# EAGLE board electronGPS (EAGLE 7.3.0)
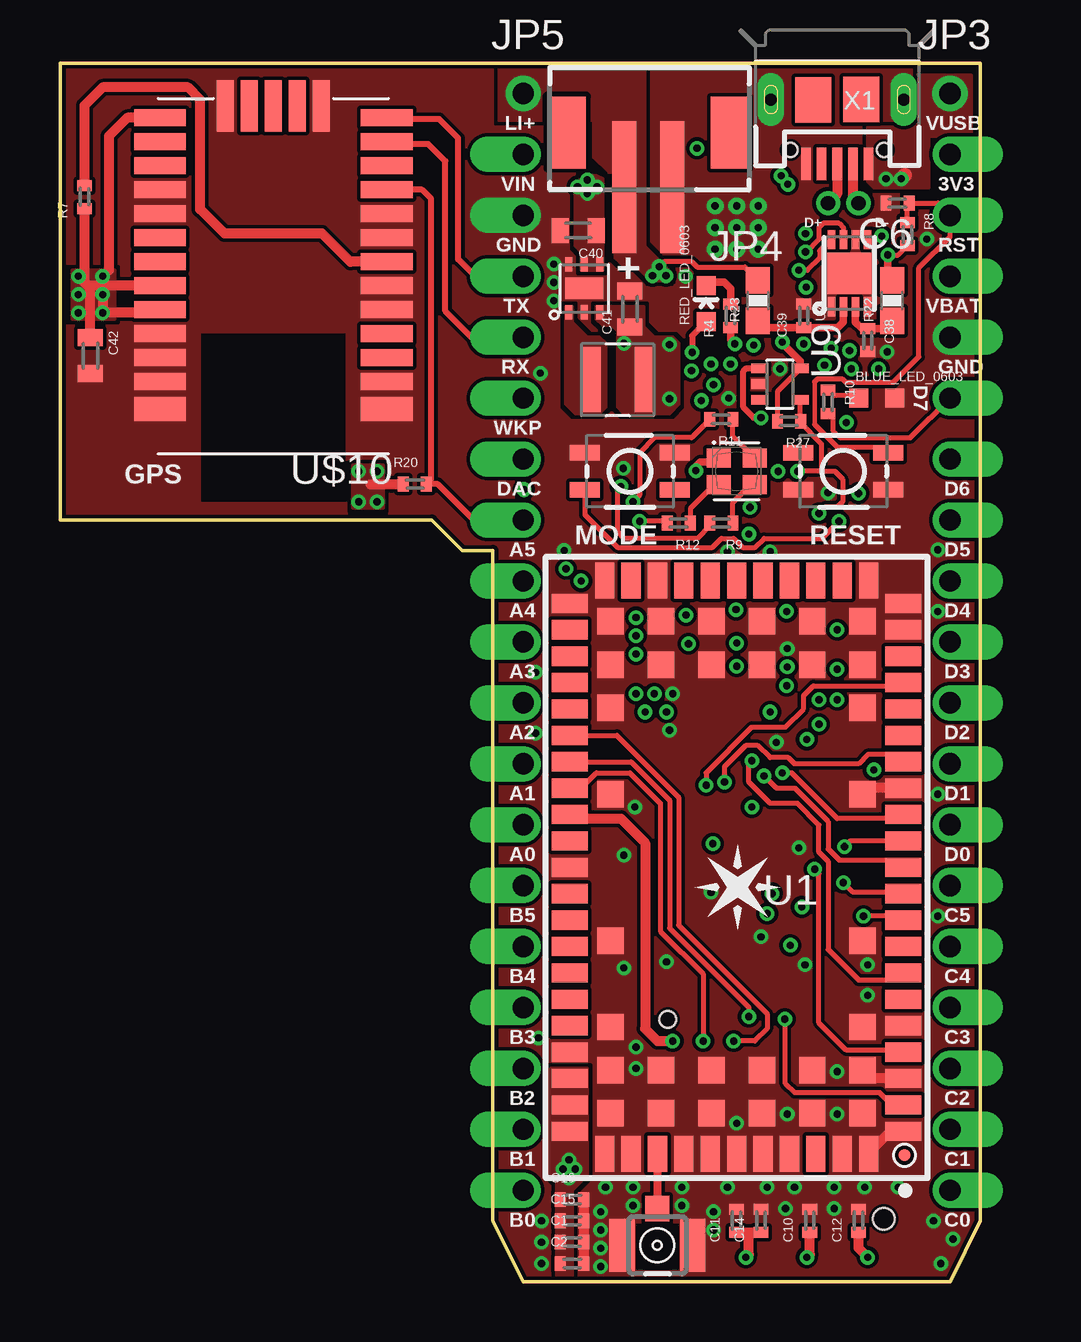
[diagram p4: board, top side]
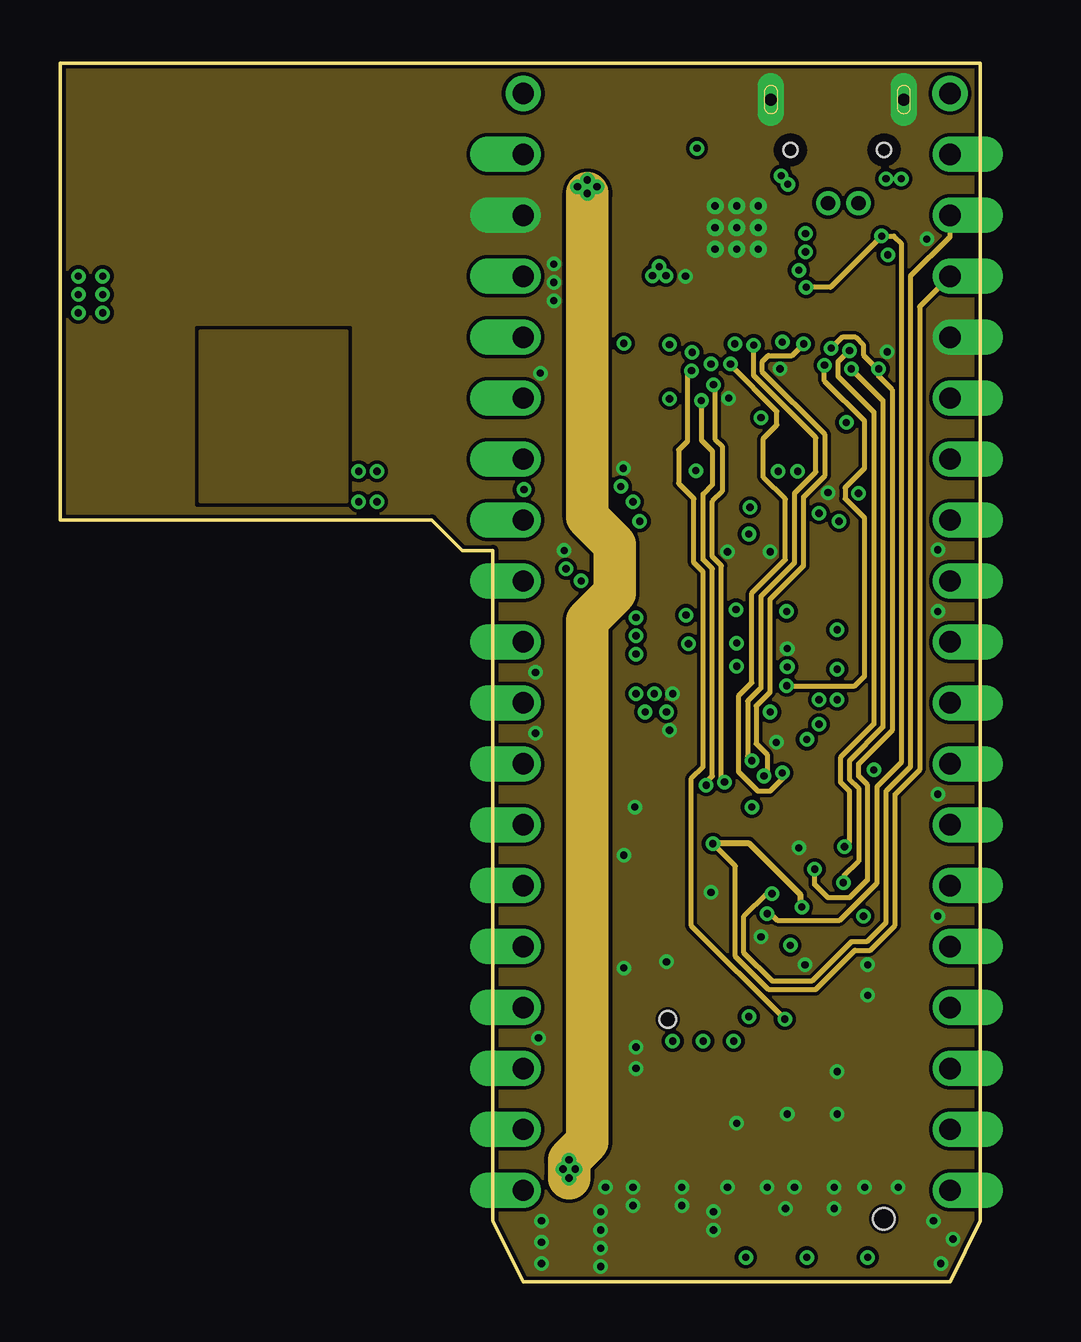
[diagram p5: board, inner layer $GND]
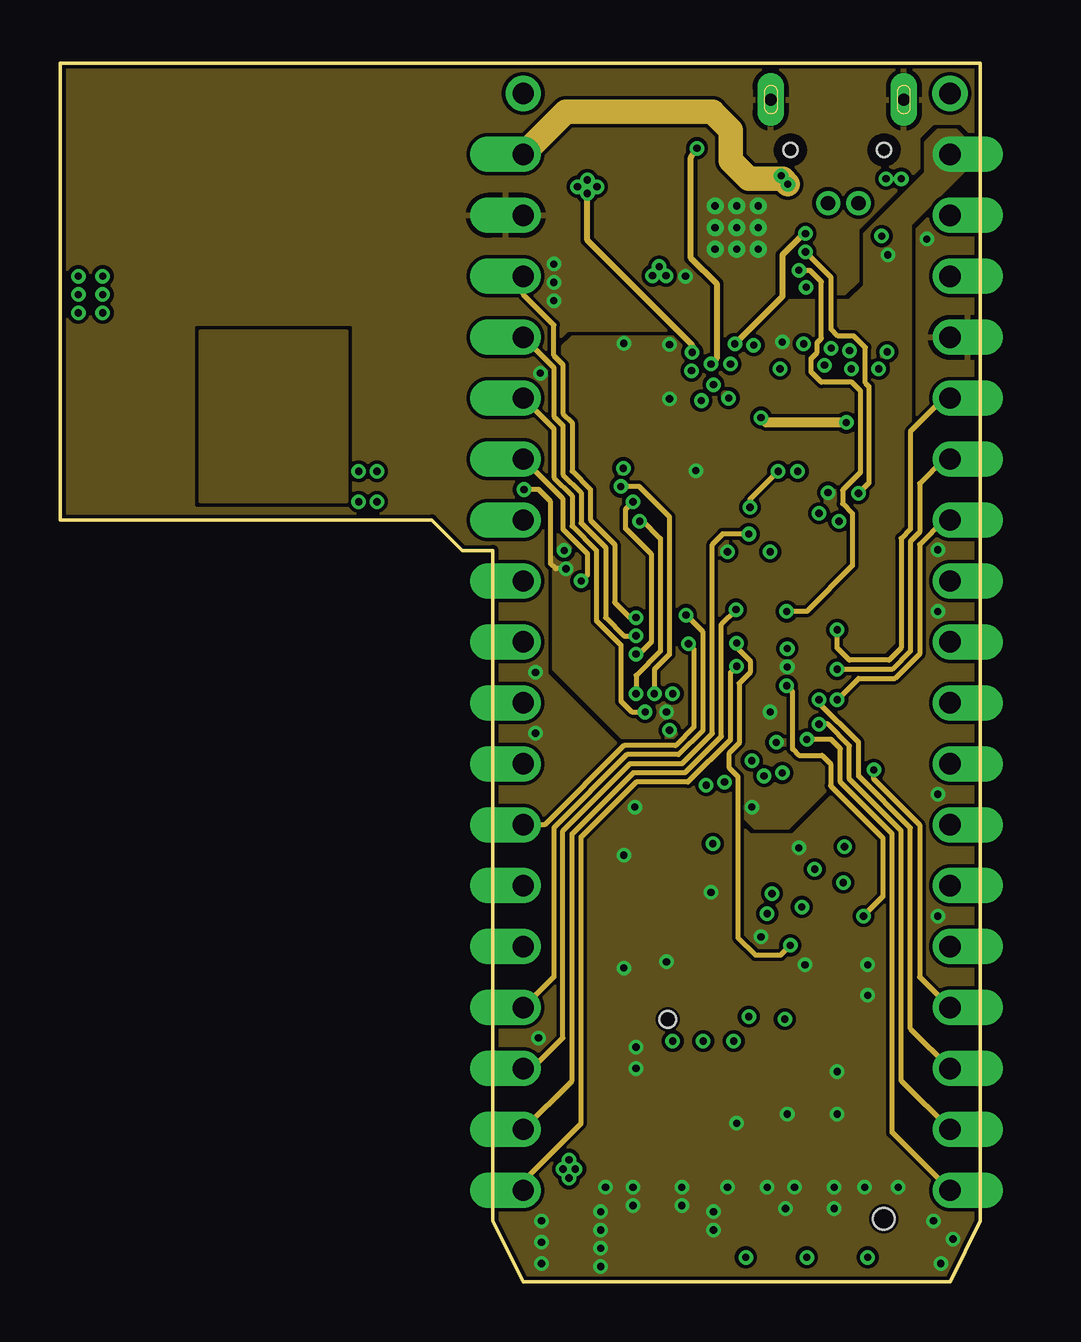
[diagram p6: board, inner layer $+3V3]
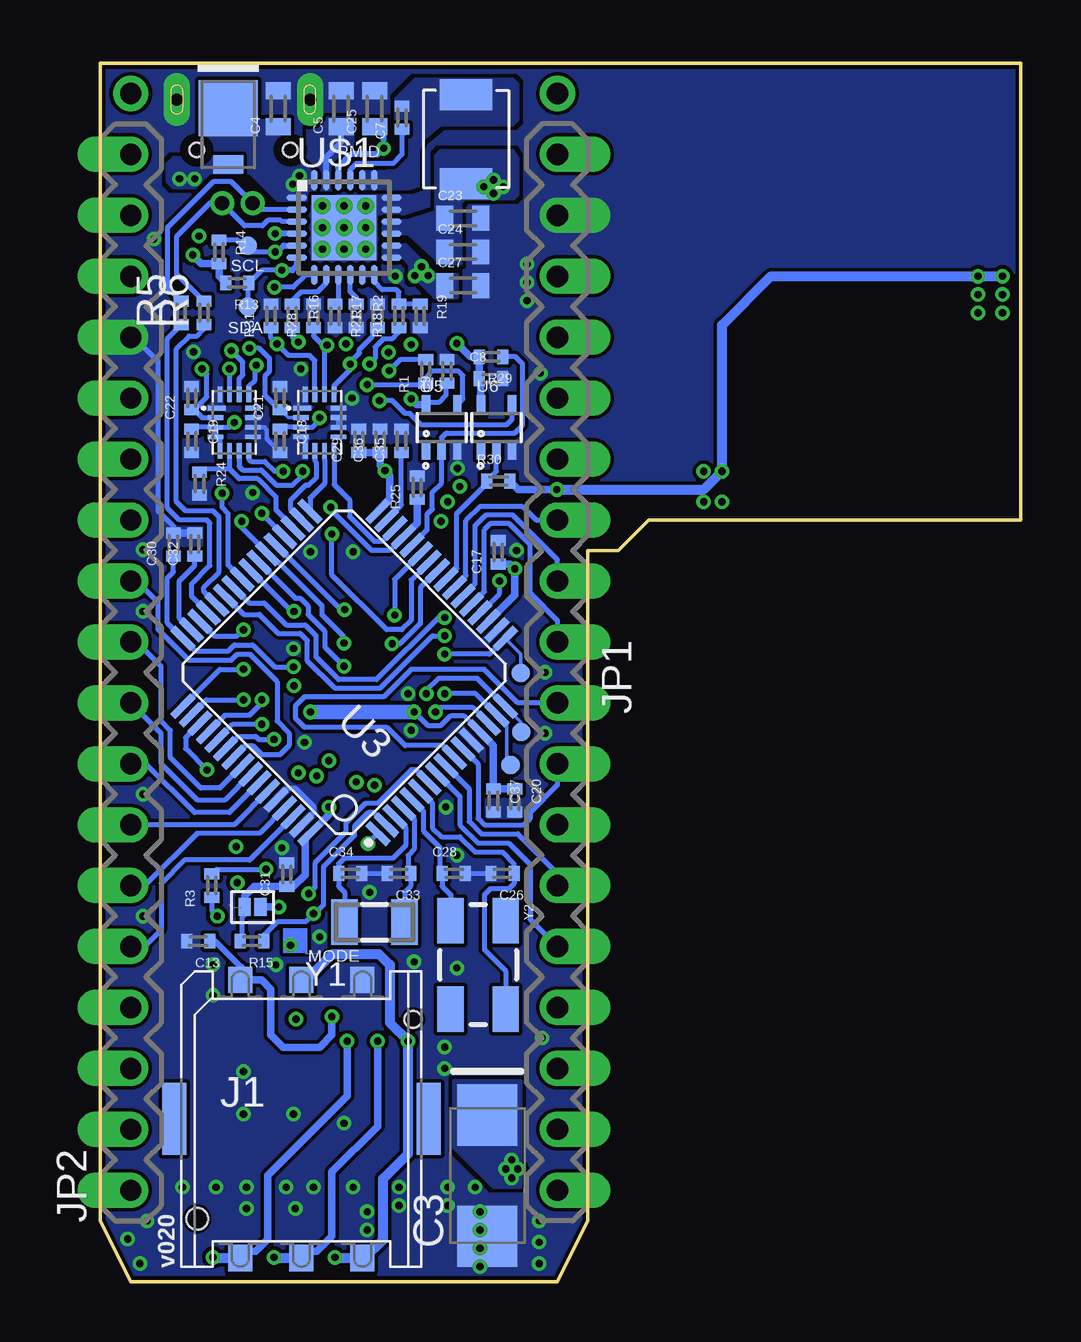
[diagram p7: board, bottom side, seen from below]

Size 38.35 x 50.8 mm. Coordinates in mm from the lower left corner, seen from the top.
Outline: 18.03,2.54 19.3,0 37.08,0 38.35,2.54 38.35,50.8 0,50.8 0,31.75 15.49,31.75 16.76,30.48 18.03,30.48 18.03,2.54
Copper layers (1+2*15+16): Top 0.018mm / dielectric 0.195mm / $GND 0.035mm / dielectric 1.1mm / $+3V3 0.035mm / dielectric 0.195mm / Bottom 0.018mm
Design rules "particle-4layer": minimum track width 6mil, minimum drill 0.3mm, track to track 6mil, track to pad 6mil, pad to pad 6mil, via to via 6mil, smd to smd 6mil, copper to edge 6mil, drill to drill 6mil, minimum pad ring 8mil, minimum via ring 6mil, stop-mask expansion 4mil, vias tented up to drill 20mil, thermal gap 8mil
Net classes: 2 RF: width 0.33 mm, clearance 0.191 mm; 3 BAT: clearance 0.203 mm

## Footprints (pad centres in the part's own frame; a part is rotated, then mirrored left to right if it is on the bottom)
LED-0603-NS = smd 0.8 x 0.8: A -0.75,0; C 0.75,0
C0402_B = smd 0.457 x 0.61: 1 -0.483,0; 2 0.483,0
C/6032-28R = smd 2.55 x 2.5: + 2.525,0; - -2.525,0
C0603_B = smd 0.711 x 1.041: 1 -0.749,0; 2 0.749,0
GCT-SIM8100 = smd 1 x 1.1: C1 2.54,-5.8; C2 0,-5.8; C3 -2.54,-5.8; C5 2.54,5.8; C6 0,5.8; C7 -2.54,5.8 | smd 1 x 3: NC@1 -5.3,0; NC@2 5.3,0 | hole 0.7: 4.65,4.15 | hole 0.9: -4.35,-4.15
IPEX-20279-001E = smd 1 x 1.05: 1 0,1.528 | smd 1.05 x 2.2: 2@1 -1.475,0; 2@2 1.475,0
JUMPER_SMD_NC = smd 0.508 x 0.762: 1 -0.33,0; 2 0.33,0
1X18-D-PADS = drill 0.889 pad 1.473 offset: 1 -21.59,0; 2 -19.05,0; 3 -16.51,0; 4 -13.97,0; 5 -11.43,0; 6 -8.89,0; 7 -6.35,0; 8 -3.81,0; 9 -1.27,0; 10 1.27,0; 11 3.81,0; 12 6.35,0; 13 8.89,0; 14 11.43,0; 15 13.97,0; 16 16.51,0; 17 19.05,0; 18 21.59,0
1X01_NO_SILK = drill 0.889 pad 1.473: 1 0,0
JST-2-SMD-VERT = smd 1 x 5.5: GND 1,-2; VCC -1,-2 | smd 1.6 x 3: P$1 -3.4,0.27; P$2 3.4,0.27
PLCC4-2MM-RGB = smd 1 x 0.8: BLUE -0.75,-0.55; CA 0.75,-0.55; GREEN -0.75,0.55; RED 0.75,0.55
R0402_B = smd 0.457 x 0.61: 1 -0.483,0; 2 0.483,0
0603-RES = smd 1.1 x 1: 1 -0.85,0; 2 0.85,0
LED-0603 = smd 0.8 x 0.8: A 0,-0.75; C 0,0.75
TACTILE_SWITCH_SMD = smd 1.25 x 0.65: 1 -1.875,0.775; 2 1.875,0.775; 3 -1.875,-0.775; 4 1.875,-0.775
U-BLOX-SARA-U2 = smd 1.5 x 0.8: 1 -6.95,11; 2 -6.95,9.9; 3 -6.95,8.8; 4 -6.95,7.7; 5 -6.95,6.6; 6 -6.95,5.5; 7 -6.95,4.4; 8 -6.95,3.3; 9 -6.95,2.2; 10 -6.95,1.1; 11 -6.95,0; 12 -6.95,-1.1; 13 -6.95,-2.2; 14 -6.95,-3.3; 15 -6.95,-4.4; 16 -6.95,-5.5; 17 -6.95,-6.6; 18 -6.95,-7.7; 19 -6.95,-8.8; 20 -6.95,-9.9; 21 -6.95,-11; 33 6.95,-11; 34 6.95,-9.9; 35 6.95,-8.8; 36 6.95,-7.7; 37 6.95,-6.6; 38 6.95,-5.5; 39 6.95,-4.4; 40 6.95,-3.3; 41 6.95,-2.2; 42 6.95,-1.1; 43 6.95,0; 44 6.95,1.1; 45 6.95,2.2; 46 6.95,3.3; 47 6.95,4.4; 48 6.95,5.5; 49 6.95,6.6; 50 6.95,7.7; 51 6.95,8.8; 52 6.95,9.9; 53 6.95,11 | smd 0.8 x 1.5: 22 -5.5,-11.95; 23 -4.4,-11.95; 24 -3.3,-11.95; 25 -2.2,-11.95; 26 -1.1,-11.95; 27 0,-11.95; 28 1.1,-11.95; 29 2.2,-11.95; 30 3.3,-11.95; 31 4.4,-11.95; 32 5.5,-11.95; 54 5.5,11.95; 55 4.4,11.95; 56 3.3,11.95; 57 2.2,11.95; 58 1.1,11.95; 59 0,11.95; 60 -1.1,11.95; 61 -2.2,11.95; 62 -3.3,11.95; 63 -4.4,11.95; 64 -5.5,11.95 | smd 1.1 x 1.1: 65 -5.25,10.25; 66 -3.15,10.25; 67 -1.05,10.25; 68 1.05,10.25; 69 3.15,10.25; 70 5.25,10.25; 71 -5.25,8.45; 72 -3.15,8.45; 73 -1.05,8.45; 74 1.05,8.45; 75 3.15,8.45; 76 5.25,8.45; 77 -5.25,6.65; 78 5.25,6.65; 79 -5.25,3.05; 80 5.25,3.05; 81 -5.25,-3.05; 82 5.25,-3.05; 83 -5.25,-6.65; 84 5.25,-6.65; 85 -5.25,-8.45; 86 -3.15,-8.45; 87 -1.05,-8.45; 88 1.05,-8.45; 89 3.15,-8.45; 90 5.25,-8.45; 91 -5.25,-10.25; 92 -3.15,-10.25; 93 -1.05,-10.25; 94 1.05,-10.25; 95 3.15,-10.25; 96 5.25,-10.25 | smd 0.5 x 0.5: FID_PIN1 -7,12
UFQFN-16 = smd 0.2 x 0.75: 1 -0.6,-0.73 | smd 0.2 x 0.65: 2 -0.2,-0.78; 3 0.2,-0.78; 4 0.6,-0.78; 9 0.6,0.78; 10 0.2,0.78; 11 -0.2,0.78; 12 -0.6,0.78 | smd 0.65 x 0.2: 5 1.18,-0.6; 6 1.18,-0.2; 7 1.18,0.2; 8 1.18,0.6; 13 -1.18,0.6; 14 -1.18,0.2; 15 -1.18,-0.2; 16 -1.18,-0.6
LQFP64 = smd 1.2 x 0.3: 1 -5.75,3.75; 2 -5.75,3.25; 3 -5.75,2.75; 4 -5.75,2.25; 5 -5.75,1.75; 6 -5.75,1.25; 7 -5.75,0.75; 8 -5.75,0.25; 9 -5.75,-0.25; 10 -5.75,-0.75; 11 -5.75,-1.25; 12 -5.75,-1.75; 13 -5.75,-2.25; 14 -5.75,-2.75; 15 -5.75,-3.25; 16 -5.75,-3.75; 33 5.75,-3.75; 34 5.75,-3.25; 35 5.75,-2.75; 36 5.75,-2.25; 37 5.75,-1.75; 38 5.75,-1.25; 39 5.75,-0.75; 40 5.75,-0.25; 41 5.75,0.25; 42 5.75,0.75; 43 5.75,1.25; 44 5.75,1.75; 45 5.75,2.25; 46 5.75,2.75; 47 5.75,3.25; 48 5.75,3.75 | smd 0.3 x 1.2: 17 -3.75,-5.75; 18 -3.25,-5.75; 19 -2.75,-5.75; 20 -2.25,-5.75; 21 -1.75,-5.75; 22 -1.25,-5.75; 23 -0.75,-5.75; 24 -0.25,-5.75; 25 0.25,-5.75; 26 0.75,-5.75; 27 1.25,-5.75; 28 1.75,-5.75; 29 2.25,-5.75; 30 2.75,-5.75; 31 3.25,-5.75; 32 3.75,-5.75; 49 3.75,5.75; 50 3.25,5.75; 51 2.75,5.75; 52 2.25,5.75; 53 1.75,5.75; 54 1.25,5.75; 55 0.75,5.75; 56 0.25,5.75; 57 -0.25,5.75; 58 -0.75,5.75; 59 -1.25,5.75; 60 -1.75,5.75; 61 -2.25,5.75; 62 -2.75,5.75; 63 -3.25,5.75; 64 -3.75,5.75
TDFN-8 = smd 0.8 x 0.3: 1 -1.4,0.75; 2 -1.4,0.25; 3 -1.4,-0.25; 4 -1.4,-0.75; 5 1.4,-0.75; 6 1.4,-0.25; 7 1.4,0.25; 8 1.4,0.75 | smd 1.73 x 1.88: EP 0,0
SC-70-5 = smd 0.35 x 0.8: 1 -0.65,-0.95; 2 0,-0.95; 3 0.65,-0.95; 4 0.65,0.95; 5 -0.65,0.95
SC70-5 = smd 0.4 x 0.7: 1 -0.65,-0.85; 2 0,-0.85; 3 0.65,-0.85; 4 0.65,0.85; 5 -0.65,0.85
QFN24 = smd 0.85 x 0.28: 1 -1.975,1.25; 2 -1.975,0.75; 3 -1.975,0.25; 4 -1.975,-0.25; 5 -1.975,-0.75; 6 -1.975,-1.25; 13 1.975,-1.25; 14 1.975,-0.75; 15 1.975,-0.25; 16 1.975,0.25; 17 1.975,0.75; 18 1.975,1.25 | smd 0.28 x 0.85: 7 -1.25,-1.975; 8 -0.75,-1.975; 9 -0.25,-1.975; 10 0.25,-1.975; 11 0.75,-1.975; 12 1.25,-1.975; 19 1.25,1.975; 20 0.75,1.975; 21 0.25,1.975; 22 -0.25,1.975; 23 -0.75,1.975; 24 -1.25,1.975 | smd 2.7 x 2.7: PAD 0,0 | drill 0.3 pad 0.406: PAD@1 -0.9,0.9; PAD@2 0,0.9; PAD@3 0.9,0.9; PAD@4 -0.9,0; PAD@5 0,0; PAD@6 0.9,0; PAD@7 -0.9,-0.9; PAD@8 0,-0.9; PAD@9 0.9,-0.9
DIODE-DO-220AA_NT(SMP) = smd 0.762 x 1.27: ANODE 2.349,0 | smd 2.337 x 2.464: CATHODE 0,0
4020TYPE_NT = smd 1.295 x 2.184: P$1 -1.854,0; P$2 1.854,0
S-PWSON-N6 = smd 0.3 x 0.6: P$1 -0.65,-1; P$2 0,-1; P$3 0.65,-1; P$4 0.65,1; P$5 0,1; P$6 -0.65,1 | smd 1.6 x 0.9: TP 0,0
INDUCTOR-NR3015 = smd 0.8 x 2.7: 1 -1.1,0; 2 1.1,0
M02_0.05_HEADER = drill 0.6 pad 1: P$1 -0.635,0; P$2 0.635,0
TP30_BOT = smd 0.762 x 0.762 bottom: P$1 0,0
CAM-MC = smd 2.15 x 0.7: P$1 4.725,0; P$2 4.725,1; P$3 4.725,2; P$4 4.725,3; P$5 4.725,4; P$6 4.725,5; P$7 4.725,6; P$8 4.725,7; P$9 4.725,8; P$10 4.725,9; P$11 4.725,10; P$12 4.725,11; P$15 -4.725,11; P$16 -4.725,10; P$17 -4.725,9; P$18 -4.725,8; P$19 -4.725,7; P$20 -4.725,6; P$21 -4.725,5; P$22 -4.725,4; P$23 -4.725,3; P$24 -4.725,2; P$25 -4.725,1; P$26 -4.725,0 | smd 2.15 x 1: P$13 4.725,12.15; P$14 -4.725,12.15 | smd 0.7 x 2.15: P$27 -2,-0.5; P$28 -1,-0.5; P$29 0,-0.5; P$30 1,-0.5; P$31 2,-0.5
USB-MICROB-SLOT-HOLE = smd 0.4 x 1.35: D+ 0,2.675; D- -0.65,2.675; GND 1.3,2.675; ID 0.65,2.675; VBUS -1.3,2.675 | drill 0.5 pad 1.1 long: MT1 -2.775,0; MT2 2.775,0 | smd 1.5 x 1.9: P$1 -1,0; P$2 1,0.01 | hole 0.6: -1.95,2.1; 1.95,2.1
FC135 = smd 1.1 x 1.9: X1 -1.25,0; X2 1.25,0
CRYSTAL-SMD-5X3 = smd 1.9 x 1.1: 1 -1.85,-1.15; 2 1.85,-1.15; 3 1.85,1.15; 4 -1.85,1.15

## Placement (x,y rotation side)
BLUE_LED_0603  [LED-0603-NS]  34.04,36.83 0 top
C1  10nF  [C0402_B]  21.34,1.65 0 top
C2  0.1uF  [C0402_B]  21.34,0.76 0 top
C3  220uF  [C/6032-28R]  22.22,4.42 90 bottom
C4  1uF  [C0603_B]  30.94,48.9 90 bottom
C5  20uF  [C0603_B]  28.32,48.9 90 bottom
C6  0.1uF  [C0402_B]  34.9,44.96 180 top
C7  47nF  [C0402_B]  25.78,48.51 90 bottom
C8  0.1uF  [C0402_B]  22.07,37.64 0 bottom
C9  0.1uF  [C0402_B]  23.9,37.95 90 bottom
C10  47pF  [C0402_B]  31.24,2.54 90 top
C11  47pF  [C0402_B]  28.19,2.54 90 top
C12  47pF  [C0402_B]  33.27,2.54 90 top
C13  47pF  [C0402_B]  34.26,14.2 180 bottom
C14  0.1uF  [C0402_B]  29.21,2.54 90 top
C15  68pF  [C0402_B]  21.34,2.54 0 top
C16  15pF  [C0402_B]  21.34,3.43 0 top
C17  0.1uF  [C0402_B]  21.77,30.4 90 bottom
C18  0.1uF  [C0402_B]  30.86,35.05 270 bottom
C19  0.1uF  [C0402_B]  34.54,35.05 270 bottom
C20  0.1uF  [C0402_B]  21.08,20.07 270 bottom
C21  0.1uF  [C0402_B]  30.86,36.83 90 bottom
C22  0.1uF  [C0402_B]  34.54,36.83 90 bottom
C23  10uF  [C0603_B]  23.24,44.32 0 bottom
C24  10uF  [C0603_B]  23.24,42.93 0 bottom
C25  4.7uF  [C0603_B]  26.92,48.9 90 bottom
C26  20pF  [C0402_B]  21.59,17.02 180 bottom
C27  10uF  [C0603_B]  23.24,41.53 0 bottom
C28  20pF  [C0402_B]  23.62,17.02 0 bottom
C29  0.1uF  [C0402_B]  27.58,35.05 90 bottom
C30  0.1uF  [C0402_B]  35.31,30.73 90 bottom
C31  0.1uF  [C0402_B]  30.58,16.97 90 bottom
C32  2.2uF  [C0402_B]  34.42,30.73 90 bottom
C33  12pF  [C0402_B]  25.91,17.02 180 bottom
C34  12pF  [C0402_B]  27.94,17.02 0 bottom
C35  2.2uF  [C0402_B]  25.81,35.05 90 bottom
C36  4.7uF  [C0402_B]  26.7,35.05 90 bottom
C37  1uF  [C0402_B]  21.97,20.07 270 bottom
C38  10nF  [C0402_B]  33.66,39.24 270 top
C39  1uF  [C0402_B]  30.99,40.26 90 top
C40  10uF  [C0603_B]  21.59,43.82 180 top
C41  10uF  [C0603_B]  23.74,40.53 90 top
C42  10uF  [C0603_B]  1.27,38.61 270 top
J1  SIM-NANO-4FF  [GCT-SIM8100]  29.97,6.78 0 bottom
J2  IPEX-20279-001E  [IPEX-20279-001E]  24.89,1.52 0 top
J3  JUMPER_NC_SMD  [JUMPER_SMD_NC]  32,15.62 0 bottom
JP1  M18DPAD  [1X18-D-PADS]  19.3,25.4 270 bottom
JP2  M18DPAD  [1X18-D-PADS]  37.08,25.4 90 bottom
JP3  [1X01_NO_SILK]  37.08,49.53 0 top
JP4  [JST-2-SMD-VERT]  24.51,47.62 0 top
JP5  [1X01_NO_SILK]  19.3,49.53 0 top
LED2  RGB-LED-CLMVB-FKARGB  [PLCC4-2MM-RGB]  28.19,33.78 180 top
R1  100k  [R0402_B]  24.79,37.95 90 bottom
R2  333R  [R0402_B]  27.69,40.26 270 bottom
R3  10K  [R0402_B]  33.71,16.51 90 bottom
R4  2.2K  [R0402_B]  27.94,40.26 90 top
R5  22  [R0402_B]  34.98,40.39 90 bottom
R6  22  [R0402_B]  34.04,40.39 90 bottom
R7  10K  [R0402_B]  1.02,45.21 90 top
R8  10K  [R0402_B]  35.31,43.66 270 top
R9  1K  [R0402_B]  27.56,31.62 180 top
R10  1K  [R0402_B]  32,36.68 270 top
R11  1K  [R0402_B]  27.56,35.94 180 top
R12  1K  [R0402_B]  25.78,31.62 180 top
R13  4K7  [R0402_B]  32.64,41.63 180 bottom
R14  4K7  [R0402_B]  33.4,42.93 270 bottom
R15  10K  [R0402_B]  32.03,14.2 180 bottom
R16  10K  [R0402_B]  30.35,40.26 270 bottom
R17  10K  [R0402_B]  28.57,40.26 270 bottom
R18  5.52K  [R0402_B]  25.91,40.26 90 bottom
R19  10K  [R0402_B]  25.02,40.26 270 bottom
R20  10K  [R0402_B]  14.78,33.25 0 top
R21  10K  [R0402_B]  26.8,40.26 90 bottom
R22  150  [0603-RES]  34.67,40.89 90 top
R23  1K  [0603-RES]  29.08,40.89 90 top
R24  10K  [R0402_B]  34.21,33.27 270 bottom
R25  10K  [R0402_B]  25.15,33.1 90 bottom
R27  10K  [R0402_B]  30.38,35.86 180 top
R28  10K  [R0402_B]  29.46,40.26 90 bottom
R29  10K  [R0402_B]  22.07,38.56 180 bottom
R30  10K  [R0402_B]  21.77,33.38 0 bottom
R31  10K  [R0402_B]  31.24,40.26 90 bottom
RED_LED_0603  [LED-0603]  26.92,40.77 0 top
RESET  KMR211GLFS  [TACTILE_SWITCH_SMD]  32.64,33.78 0 top
SETUP  KMR211GLFS  [TACTILE_SWITCH_SMD]  23.75,33.78 0 top
U1  U-BLOX-SARA-U260  [U-BLOX-SARA-U2]  28.19,17.27 180 top
U2  SN74AVC4T245  [UFQFN-16]  32.77,35.81 270 bottom
U3  STM32F205RG  [LQFP64]  28.19,25.4 135 bottom
U4  MAX1704X  [TDFN-8]  32.89,42.04 90 top
U5  SN74LVC1G07  [SC-70-5]  24.13,35.61 0 bottom
U6  SN74LVC1G07  [SC-70-5]  21.84,35.61 0 bottom
U8  SN74AVC4T245  [UFQFN-16]  29.21,35.81 270 bottom
U9  TPS22942DCKRSMALL  [SC70-5]  30,37.41 270 top
U$1  BQ24298 / BQ24195L  [QFN24]  28.19,43.94 0 bottom
U$2  SPARK_LOGO2  [SPARK_LOGO2]  34.37,0.25 0 top
U$3  DIODE_NT  [DIODE-DO-220AA_NT(SMP)]  33.02,48.92 270 bottom
U$4  2.2uH  [4020TYPE_NT]  23.11,47.62 270 bottom
U$5  TPS62291DRV  [S-PWSON-N6]  21.84,41.4 0 top
U$6  2.2uH - NR3015T2R2M  [INDUCTOR-NR3015]  23.24,37.6 0 top
U$7  M02_0.05_HEADER  [M02_0.05_HEADER]  32.64,44.96 0 top
U$8  TP0  [TP30_BOT]  32.21,40.64 0 top
U$9  TP0  [TP30_BOT]  32.21,43.18 0 top
U$10  CAM-M8C  [CAM-MC]  8.89,48.51 180 top
U$11  TP0  [TP30_BOT]  21.26,21.54 0 top
U$12  TP0  [TP30_BOT]  20.8,22.91 0 top
U$13  TP0  [TP30_BOT]  20.83,25.37 0 top
X1  USB-MICROB  [USB-MICROB-SLOT-HOLE]  32.38,49.28 180 top
Y1  32Khz  [FC135]  26.92,14.99 0 bottom
Y2  26Mhz  [CRYSTAL-SMD-5X3]  22.61,13.21 270 bottom

## Tracks (layer width: path | path; a pad name or v marks a point on that pad's centre or on a via)
!BATT_INT_PC13  (via drill 0.3)
  Top 0.203: U4.5 34.09,43.44 v34.24,43.59
  $GND 0.203: v29.46,15.34 29.62,15.34 29.9,15.06 32.49,15.06 34.04,16.61 34.04,20.62 35.05,21.64 35.05,43.28 34.75,43.59 v34.24,43.59 32.11,41.45 v31.09,41.45
  Bottom 0.203: U$1.7 29.79,41.97 30.3,41.45 v31.09,41.45 | U3.2 26.95,19.56 27.18,19.56 27.76,18.97 27.76,18.59 29.06,17.3 29.06,15.7 29.41,15.34 v29.46,15.34 29.79,15.01 30.96,15.01 31.55,14.43 R15.1
!CE
  Bottom 0.203: U$1.9 28.44,40.87 R17.1
!RST  (via drill 0.3)
  Top 0.178: 31.45,37.52 31.45,35.74
  Top 0.203: R8.1 35.31,44.88 C6.1 36.58,44.96 JP2.17 37.08,43.56 35.79,42.27 35.79,38.56 34.72,37.49 32.74,37.49 32.59,37.64 31.57,37.64 31.45,37.52 | RESET.2 34.3,34.77 32.41,34.77 31.45,35.74
  $GND 0.203: JP2.17 37.08,43.56 35.43,41.91 35.43,21.46 34.42,20.45 34.42,14.99 33.6,14.17 32.97,14.17 31.32,12.52 29.69,12.52 28.5,13.72 28.5,15.24 29.44,16.18 v29.67,16.18
  Bottom 0.203: U3.7 25.19,21.34 25.4,21.34 26.8,19.94 27.3,19.94 28.12,19.13 28.12,18.75 29.41,17.45 29.41,16.43 v29.67,16.18
!SETUP  (via drill 0.3)
  Top 0.203: SETUP.3 21.87,31.97 23.24,30.61 27.18,30.61 27.56,30.99 28.07,30.99 28.45,30.61 28.96,30.61 29.34,30.99 31.75,30.99 v32.46,31.7
  $+3V3 0.203: v28.19,26.62 28.19,26.44 28.75,25.88 28.75,25.4 28.3,24.94 28.3,22.45 27.89,22.05 27.89,21.41 28.24,21.06 28.24,14.35 28.98,13.61 30.02,13.61 v30.43,14.02
  Bottom 0.203: v28.19,26.62 28.19,26.87 29.11,27.79 29.11,28.17 30.91,29.97 31,29.97 U3.38 32.46,31.43 v32.46,31.7
+3V3  (via drill 0.3)
  Top 0.203: v34.49,42.8 34.92,42.8 R8.2 | U9.5 29.9,37.11 R27.2
  Top 0.305: v26.49,33.81 26.49,33.98 26.67,34.16 27.27,34.16 LED2.CA | v34.49,42.8 34.49,41.92 R22.2 | v30.1,39.17 30.1,39.12 30.85,38.37 U9.5
  Top 0.406: 1.27,39.5 C42.1 1.27,41.4 1.14,41.53 | 12.93,33.25 R20.1 | 4.28,41.4 U$10.P$8 4.15,41.53 1.14,41.53 | R7.1 1.02,41.66 v0.76,41.91 1.14,41.53 | v1.78,41.15 v1.78,40.39 4.04,40.39 U$10.P$9 | U$10.P$1 2.79,48.51 2.03,47.75 2.03,42.16 v1.78,41.91
  $+3V3 0.203: v21.08,29.72 20.65,29.72 20.45,29.92 20.45,32.51 19.94,33.02 v19.33,33.02
  Bottom 0.203: C30.1 35.31,29.59 35.56,29.34 35.56,27.46 U3.48 34.39,26.29 33.02,26.29 32.77,26.54 32,26.54 31.09,25.63 v30.3,25.63 | v25.27,23.75 24.71,23.19 24.16,23.19 23.75,23.6 23.21,23.6 U3.13 | U3.64 29.61,18.65 29.77,18.49 | C9.1 23.95,37.47 23.95,36.96 24.26,36.65 24.69,36.65 U5.5 | R15.2 32.44,14.28 32.44,15.21 32.33,15.32 J3.1
  Bottom 0.254: U3.32 26.78,32.15 | 26.52,33.81 v26.49,33.81 | R16.2 30.35,39.42 v30.1,39.17
  Bottom 0.305: U3.13 21.97,22.36 C37.1 C20.1 | U3.19 21.08,28.62 v21.08,29.72 21.29,29.92 C17.1 | U3.64 28.83,19.46 v28.83,19.79 | 26.78,32.15 26.29,32.64 26.29,33.6 v26.49,33.81 26.7,34.01 C36.1 C29.1 | U6.5 22.49,37.58 C8.1 R29.2 22.94,38.56 v23.49,39.12 | U5.5 25.16,36.56 v25.4,36.8 | v34.49,42.8 34.14,42.44 R14.2 33.4,41.91 R13.2 | 29.77,18.49 29.82,18.44 29.82,16.97 30.3,16.48 C31.1 31.93,16.48 32.33,16.08 J3.1 | v19.33,33.02 20.93,33.02 R30.2
  Bottom 0.406: v19.33,33.02 13.21,33.02 v12.45,33.78 12.45,39.88 10.41,41.91 v1.78,41.91 v0.76,41.91
  Bottom 0.61: v25.27,23.75 v29.59,23.75
  other vias: 25.4,39.07 13.21,33.78 12.45,32.51 13.21,32.51 0.76,41.15 0.76,40.39
  pour $+3V3 (no thermals): 20.95,38.99 21.34,39.37 28.45,39.37 29.97,40.89 32.89,40.89 33.53,41.53 33.53,43.69 36.07,46.23 36.07,47.5 36.58,48.01 37.34,48.01 37.72,47.62 37.72,46.35 35.43,44.07 35.43,35.43 35.43,27.3 32.64,24.51 32.64,21.21 30.35,18.92 28.96,18.92 25.53,22.35 23.75,22.35 20.57,25.53 20.57,30.48 20.95,30.86
  pour Top (rank 2, no thermals): 22.35,40.64 24.33,40.64 24.33,39.8 24.77,39.37 25.53,39.37 25.78,39.12 25.78,36.58 25.4,36.2 23.49,36.2 23.24,36.45 23.24,39.62 22.99,39.88 22.61,39.88 22.35,40.13
  pour $GND: 5.84,39.62 11.94,39.62 11.94,32.51 5.84,32.51
  pour $+3V3: 5.84,39.62 11.94,39.62 11.94,32.51 5.84,32.51
  pour Top: 12.19,34.04 12.19,32.26 13.46,32.26 13.46,34.04
  pour Top: 0.51,42.16 2.29,42.16 2.29,40.13 0.51,40.13
+3V8  (via drill 0.3)
  Top 0.254: RED_LED_0603.A 26.34,39.43 v26.34,38.73
  Top 0.406: RED_LED_0603.A 27.08,39.87
  $GND 1.778: v21.21,4.32 v21.21,5.08 21.97,5.84 21.97,27.56 23.11,28.7 23.11,30.73 21.97,31.88 v21.97,45.36
  $+3V3 0.254: v21.97,45.36 21.97,43.41 26.34,39.04 v26.34,38.73
  other vias: 21.97,45.92 21.56,45.64 22.38,45.64 21.46,4.7 20.95,4.7
  pour Bottom (no thermals): 20.83,8.38 23.62,8.38 23.62,5.59 21.97,3.94 20.83,3.94
  pour Top (no thermals): 20.45,8.89 21.97,8.89 21.97,4.45 21.34,3.81 21.34,0.25 20.7,0.25 20.7,4.19 20.45,4.45
  pour Bottom (no thermals): 26.57,44.22 26.57,43.69 25.53,43.69 24.16,42.44 23.34,42.44 23.34,44.96 23.16,45.14 21.13,45.14 20.95,45.31 20.95,46.81 21.16,47.14 24.18,47.14 24.38,46.94 24.38,44.6 25.53,44.22
  pour Top (no thermals): 22.61,42.16 21.72,42.16 21.72,42.93 21.46,43.18 21.46,45.72 21.84,46.1 22.35,46.1 22.61,45.97
A0  (via drill 0.3)
  $+3V3 0.203: v26.19,26.59 26.42,26.36 26.42,23.11 25.65,22.35 23.49,22.35 20.19,19.05 JP1.12
  Bottom 0.203: U3.25 25.02,28.93 25.02,27.43 25.86,26.59 v26.19,26.59
A1
  Bottom 0.203: U3.11 22.61,21.58 22.61,19.3 22.35,19.05 20.7,19.05 20.45,19.3 20.45,19.56 19.3,20.7 JP1.11
A2
  Bottom 0.203: JP1.10 20.95,24.13 22.35,25.53 25.4,25.53 26.54,24.38 29.84,24.38 30.23,24 30.23,23.5 29.84,23.11 26.42,23.11 25.65,22.35 24.09,22.35 U3.10
A3
  Bottom 0.203: U3.21 22.35,28.77 22.35,31.34 22.1,31.6 21.31,31.6 20.45,30.73 20.45,28.7 19.3,27.56 JP1.9
A4
  Bottom 0.203: U3.22 22.73,29.09 22.73,31.52 22.3,31.95 21.16,31.95 19.3,30.1 JP1.8
A5
  Top 0.254: JP1.7 17.25,31.75 15.75,33.25 R20.2 15.47,33.45 15.47,45.14 15.09,45.51 U$10.P$23
  Bottom 0.203: U3.23 23.11,29.42 23.11,31.73 22.53,32.31 20.75,32.31 20.19,31.75 JP1.7
ANT
  Top 0.33: U1.56 J2.1
  Top 0.61: J2.1
B0  (via drill 0.3)
  $+3V3 0.203: JP1.18 19.3,4.19 21.72,6.6 21.72,18.54 24,20.83 26.16,20.83 27.94,22.61 27.94,25.4 v28.19,25.65
  Bottom 0.203: U3.39 30.23,28.5 30.02,28.5 29.69,28.17 29.69,27.81 28.98,27.1 28.98,26.44 v28.19,25.65
B1  (via drill 0.3)
  $+3V3 0.203: JP1.17 21.34,8.38 21.34,18.67 23.88,21.21 26.03,21.21 27.56,22.73 27.56,27.41 v28.17,28.02
  Bottom 0.203: U3.37 28.34,28.02 v28.17,28.02
B2  (via drill 0.3)
  $+3V3 0.203: JP1.16 19.68,8.89 20.95,10.16 20.95,18.8 23.75,21.59 25.91,21.59 27.18,22.86 27.18,30.73 27.61,31.17 v28.7,31.17
  Bottom 0.203: U3.26 25.4,29.25 25.4,27.56 25.78,27.18 26.42,27.18 28.7,29.46 v28.7,31.17
B3  (via drill 0.3)
  $+3V3 0.203: JP1.15 20.57,12.7 20.57,18.92 23.62,21.97 25.78,21.97 26.8,22.99 26.8,27.08 v26.09,27.79
  Bottom 0.203: U3.27 26.09,29.28 v26.09,27.79
B4
  Bottom 0.203: U3.8 23.37,20.22 23.37,19.05 22.61,18.29 21.34,18.29 20.45,17.4 20.45,15.11 JP1.14
B5
  Bottom 0.203: JP1.13 19.3,17.02 20.95,18.67 22.48,18.67 22.99,19.18 22.99,20.55 U3.9
BAT  (via drill 0.3)
  Top 0.203: R23.2 28.54,42.29 26.54,42.29 26.31,42.52 25.17,42.52 v24.97,42.32
  other vias: 24.69,41.94 25.25,41.94
  pour Bottom (rank 3, no thermals): 26.57,43.21 26.57,42.7 25.76,42.7 25.45,42.39 25.45,41.78 25.35,41.68 25.07,41.68 24.41,41.02 23.47,41.02 23.47,41.99 24.38,41.99 25.6,43.21
  pour Top (rank 3, no thermals): 23.11,48.39 24.38,48.39 24.38,43.18 25.45,42.11 25.45,42.01 25.45,41.78 25.37,41.71 24.59,41.71 24,42.29 23.49,42.29 23.11,42.67
  pour Top (no thermals): 18.29,48.39 22.22,48.39 22.22,46.86 22.86,46.23 24.38,46.23 24.38,50.55 18.29,50.55
BTST
  Bottom 0.203: C7.1 25.65,47.9 25.78,47.78 25.78,46.99 26.16,46.61 27.69,46.61 27.94,46.35 U$1.21
C0  (via drill 0.3)
  $+3V3 0.203: v31.11,22.61 32.13,22.61 32.51,22.23 32.51,20.83 34.67,18.67 34.67,6.22 JP2.1
  Bottom 0.203: U3.54 32.63,22.73 31.88,22.73 31.75,22.61 v31.11,22.61
C1  (via drill 0.3)
  $+3V3 0.203: v31.62,23.24 32,23.24 32.89,22.35 32.89,20.95 35.05,18.8 35.05,8.38 JP2.2
  Bottom 0.203: U3.53 32.83,23.24 v31.62,23.24
C2  (via drill 0.3)
  $+3V3 0.203: v31.62,24.26 31.62,24.13 33.27,22.48 33.27,21.08 35.43,18.92 35.43,10.54 JP2.3
  Bottom 0.203: U3.52 33.15,23.62 32.13,23.62 31.62,24.13 v31.62,24.26
C3  (via drill 0.3)
  $+3V3 0.203: v33.91,21.34 33.91,20.95 35.81,19.05 35.81,12.7 JP2.4
  Bottom 0.203: U3.51 34.8,22.68 34.8,22.23 v33.91,21.34
C4
  Bottom 0.203: 36.45,13.97 36.5,13.97 | 36.5,13.97 JP2.5 | U3.62 32.13,17.58 34.85,17.58 35.81,16.61 35.81,14.66 36.5,13.97
C5
  Bottom 0.203: JP2.6 36.45,16.51 36.45,16.56 34.31,18.69 31.72,18.69 U3.61
CTS_UB  (via drill 0.3)
  Top 0.203: v29.34,21.08 29.84,20.57 30.61,20.57 32,19.18 32,18.03 32.46,17.58 34.84,17.58 U1.11
  $GND 0.203: v29.34,21.08 29.46,21.21 29.46,21.97 29.01,22.43 29.01,24 29.59,24.59 29.59,28.45 30.99,29.84 30.99,32.72 31.88,33.6 31.88,35.31 29.26,37.92 29.26,38.35 29.52,38.61 30.5,38.61 v30.99,39.09
  Bottom 0.203: U8.15 29.41,38.4 29.62,38.61 30.5,38.61 v30.99,39.09 31.24,39.34 R31.1 31.24,39.75
CTS_UC
  Bottom 0.203: U8.6 29.41,34.21 29.36,34.16 29.36,33.5 29.67,33.2 29.79,33.2 30.43,32.56 30.43,32.21 29.99,31.76 U3.34
D0
  Bottom 0.203: U3.59 32.78,19.05 JP2.7
D1
  Bottom 0.203: U3.58 32.98,19.56 34.42,19.56 36.45,21.59 JP2.8
D2
  Bottom 0.203: U3.57 33.17,20.07 34.29,20.07 35.81,21.59 35.81,22.86 JP2.9
D3
  Bottom 0.203: U3.56 33.37,20.57 34.16,20.57 35.43,21.84 35.43,22.99 35.81,23.37 35.81,25.65 36.83,26.67 JP2.10
D4
  Bottom 0.203: U3.55 32.3,22.35 32,22.35 31.62,21.97 30.86,21.97 30.48,22.35 30.48,22.86 30.99,23.37 30.99,25.02 32.13,26.16 32.64,26.16 32.89,25.91 34.67,25.91 35.94,27.18 35.94,28.32 36.83,29.21 JP2.11
D5  (via drill 0.3)
  $+3V3 0.203: v32.38,24.26 33.27,25.15 34.8,25.15 35.81,26.16 35.81,30.73 36.83,31.75 JP2.12
  Bottom 0.203: U3.50 33.93,24.26 v32.38,24.26
D6  (via drill 0.3)
  $+3V3 0.203: v32.38,25.53 34.67,25.53 35.43,26.29 35.43,30.86 35.81,31.24 35.81,33.27 36.83,34.29 JP2.13
  Bottom 0.203: U3.49 33.37,25.53 v32.38,25.53
D7  (via drill 0.3)
  Top 0.203: JP2.14 35.43,35.18 32.51,35.18 32.21,35.48 32.21,36.07 32.08,36.2 R10.2
  $+3V3 0.203: v32.38,27.18 32.38,26.42 32.89,25.91 34.54,25.91 35.05,26.42 35.05,30.99 35.43,31.37 35.43,35.43 36.83,36.83 JP2.14
  Bottom 0.203: U3.46 33.61,26.92 32.64,26.92 v32.38,27.18
DSEL_PP
  Top 0.406: U$10.P$20 12.1,42.51 10.92,43.69 6.86,43.69 5.84,44.7 5.84,49.28 5.33,49.78 1.78,49.78 1.02,49.02 R7.2
DTR_UB  (via drill 0.3)
  Top 0.203: U1.9 34.98,15.24 v33.48,15.24
  $GND 0.203: v30.28,24.84 33.12,24.84 33.53,25.25 33.53,31.83 32.71,32.64 32.71,33.1 33.53,33.91 33.53,35.87 31.85,37.54 v31.85,38.2
  $+3V3 0.203: v33.48,15.24 34.29,16.05 34.29,18.49 32.11,20.68 32.11,21.59 31.75,21.95 30.78,21.95 30.53,22.2 30.53,24.59 v30.28,24.84
  Bottom 0.203: U2.13 32.17,37.33 31.9,37.59 31.9,38.15 v31.85,38.2 | R3.1 33.71,15.47 v33.48,15.24
DTR_UC  (via drill 0.3)
  Top 0.203: 31.77,33.78 v30.73,33.78 | v31.62,32.03 31.9,32.31 32.41,32.31 32.61,32.51 32.61,33.45 32.28,33.78 31.77,33.78 | 31.77,33.78 31.73,33.83 31.73,34.92 30.86,35.79 R27.1 30.85,35.88 U9.4
  Bottom 0.203: U3.36 31.62,32.01 v31.62,32.03 | U2.8 32.16,34.29 32.05,34.19 31.5,34.19 31.09,33.78 v30.73,33.78
GND  (via drill 0.3)
  Top 0.254: 33.02,24.26 33.35,23.92 U1.83
  Top 0.406: C16.2 C15.2 C1.2 C2.2 | U1.64 33.69,5.37 34.54,6.22 35.09,6.22 U1.1 | U1.3 33.79,8.47 U1.71 | U1.14 33.69,20.57 U1.81
  Bottom 0.178: U2.10 31.52,35.61 31.42,35.51 31.42,35.13 C18.2
  Bottom 0.203: C28.2 C26.2 | C34.2 C33.2 | U3.60 30.54,20.57 30.23,20.57 29.46,19.81 29.46,19.56 29.96,19.06 U3.63 | U8.11 U8.10 | C30.2 35.31,31.5 35.94,32.13 35.94,38.35 36.96,39.37 | U8.5 29.81,35.21 U8.4
  Bottom 0.305: C32.2 C30.2
  other vias: 21.01,30.48 19.81,22.86 27.13,16.23 23.49,13.08 25.27,13.34 29.21,14.38 32,32.89 34.47,38.76 27.86,36.83 20.07,2.54 20.07,0.76 22.73,3.94 32.26,3.94 25.91,3.94 27.81,3.94 23.88,3.94 30.61,3.94 29.46,3.94 34.92,3.94 36.4,2.54 36.7,0.76 33.53,3.94 19.94,10.16 24,8.89 30.3,6.99 33.66,11.94 32.38,8.76 24,9.78 23.49,17.78 23.95,19.79 25.4,22.99 30.3,26.39 36.58,27.94 36.58,20.32 36.58,15.24 32.38,6.99 28.19,6.6 29.84,22.48 30,38.05 25.53,24.51 23.47,33.91 19.81,25.4 31.04,13.21 33.66,13.21 37.21,1.78 20.07,1.65 20.57,40.89 26.06,41.91 30.78,18.08 27.81,30.43 29.59,30.43 20.57,41.66 36.12,43.46 27.23,2.16 23.88,3.17 25.91,3.17 27.23,2.92 22.53,2.16 22.53,2.92 22.53,1.4 22.53,0.64 30.23,3.05 32.26,3.05 20.57,42.42 20.02,37.87 36.58,30.51
  pour Top (rank 4, no thermals): 18.03,2.54 19.3,0 37.08,0 38.35,2.54 38.35,50.8 0,50.8 0,31.75 15.49,31.75 16.76,30.48 18.03,30.48
  pour Bottom (rank 4, no thermals): 18.03,2.54 19.3,0 37.08,0 38.35,2.54 38.35,50.8 0,50.8 0,31.75 15.49,31.75 16.76,30.48 18.03,30.48
  pour $GND (rank 4, no thermals): 18.03,2.54 19.3,0 37.08,0 38.35,2.54 38.35,50.8 0,50.8 0,31.75 15.49,31.75 16.76,30.48 18.03,30.48
  pour $+3V3 (rank 4): 18.03,2.54 19.3,0 37.08,0 38.35,2.54 38.35,50.8 0,50.8 0,31.75 15.49,31.75 16.76,30.48 18.03,30.48
ILIM
  Bottom 0.203: R2.1 27.69,41.02 27.94,41.27 U$1.10
  Bottom 0.254: U$1.10
LED1
  Top 0.203: 33.27,36.93 32.23,36.93 R10.1
  Top 0.305: 33.27,36.93 33.31,36.93
  Top 0.406: BLUE_LED_0603.A 33.27,36.93
N$4
  cutout $GND: 29.74,47.18 arc-90 30.43,47.87 30.45,47.87 arc-91 31.12,47.18 arc-88 30.43,46.49 arc-92
N$6
  Top 0.305: RED_LED_0603.C 27.06,41.66 27.69,41.66 27.94,41.4 R4.2
N$7
  Bottom 0.203: U$1.8 28.94,41.62 29.31,41.25 30,41.25 30.35,40.89 R16.1
N$10
  cutout Top: 24,2.41 25.78,2.41 25.78,0.51 24,0.51
N$11
  Top 0.305: R23.1 29.35,39.78 C39.1 32.41,39.78 32.64,40.01 U4.2
N$12
  Top 0.305: U4.3 33.14,40.01 33.4,39.75 33.63,39.75 C38.1 34.35,39.73 R22.1
N$15
  Bottom 0.203: U3.31 25.81,32.38 C35.1
N$16
  Bottom 0.203: U3.47 35.05,27.66 35.05,29.21 34.42,29.84 C32.1
N$17
  cutout $GND: 33.64,47.18 arc-90 34.33,47.87 34.34,47.87 arc-91 35.02,47.18 arc-88 34.33,46.49 arc-92
N$18
  cutout $+3V3: 29.74,47.18 arc-90 30.43,47.87 30.45,47.87 arc-91 31.12,47.18 arc-88 30.43,46.49 arc-92
N$19
  cutout $+3V3: 33.64,47.18 arc-90 34.33,47.87 34.34,47.87 arc-91 35.02,47.18 arc-88 34.33,46.49 arc-92
N$20
  cutout Bottom: 29.74,47.18 arc-90 30.43,47.87 30.45,47.87 arc-91 31.12,47.18 arc-88 30.43,46.49 arc-92
N$21
  cutout Bottom: 33.64,47.18 arc-90 34.33,47.87 34.34,47.87 arc-91 35.02,47.18 arc-88 34.33,46.49 arc-92
N$22
  cutout $+3V3: 28.99,48.7 28.99,49.86 arc-90 29.65,50.39 29.67,50.39 arc-90 30.23,49.83 30.23,48.74 arc-90 29.69,48.16 arc-90
  cutout $+3V3: 34.54,48.7 34.54,49.83 arc-90 35.1,50.39 35.12,50.39 arc-90 35.78,49.81 35.78,48.74 arc-90 35.04,48.16 arc-90
N$27
  Top 0.203: LED2.BLUE 28.04,35.23 R11.1
N$29
  Top 0.203: R9.1 28.04,32.49 28.79,33.23 LED2.GREEN
N$54
  Top 0.203: LED2.RED 27.26,33.23 26.26,32.23 R12.1
OSC32_IN_UC
  Bottom 0.203: Y1.X1 28.17,16.24 28.42,16.48 C34.1 28.42,17.42 28.19,17.65 26.16,17.65 25.63,18.19 25.63,18.95 U3.3
OSC32_OUT_UC
  Bottom 0.203: Y1.X2 25.67,16.24 25.42,16.48 C33.1 25.53,17.12 25.53,17.78 25.27,18.03 25.27,19.3 U3.4
OSC_IN_UC
  Bottom 0.203: Y2.1 23.75,16.13 24.1,16.48 C28.1 24.21,17.12 24.21,18.11 24.89,18.8 24.89,19.62 U3.5
OSC_OUT_UC
  Bottom 0.203: Y2.3 21.46,12.95 22.35,13.84 22.35,16.13 22.1,16.38 21.34,16.38 21.11,16.61 C26.1 21.11,17.42 21.59,17.91 22.73,17.91 23.37,18.54 24.13,18.54 24.51,18.92 24.51,19.95 U3.6
P_3V3  (via drill 0.3)
  Top 0.254: v29.21,36.02 28.91,36.02 28.47,36.45 28.47,37.95 28.6,38.08 29.14,38.08 U9.1
  $+3V3 0.406: v32.77,35.81 29.41,35.81 v29.21,36.02
  Bottom 0.203: U2.3 34.54,35.61 C19.1 | U2.3 U2.4 33.37,35.21 U2.5 | C18.1 30.86,35.61 U8.3 29.51,35.61 29.21,35.92 v29.21,36.02 | U2.3 32.97,35.61 v32.77,35.81
PA8_PM_SCL  (via drill 0.3)
  Top 0.203: U4.7 32.64,43.94 32.46,44.12 31.8,44.12 31.62,43.94 31.62,43.46 31.09,42.93 v31.06,42.93
  $+3V3 0.203: v31.06,42.93 32.13,41.86 32.13,39.7 32.41,39.42 33.07,39.42 33.55,38.94 33.55,37.47 33.71,37.31 33.71,33.3 v33.27,32.87
  Bottom 0.203: U3.41 33.02,29.87 33.02,32.03 33.27,32.28 v33.27,32.87 | v31.06,42.93 32.13,42.93 arc90 U$9.P$1 32.38,43.18 32.61,43.41 R14.1
  Bottom 0.254: v31.06,42.93 30.99,42.93 30.72,43.19 U$1.5
PC9_PM_SDA  (via drill 0.3)
  Top 0.203: U4.8 32.11,43.44 31.65,42.98 31.65,42.67 31.14,42.16 v30.78,42.16
  $+3V3 0.203: v30.78,42.16 31.24,42.16 31.73,41.68 31.73,39.32 31.55,39.14 31.55,38.73 31.29,38.48 31.29,37.92 31.73,37.49 32.99,37.49 33.35,37.13 33.35,33.73 32.61,32.99 32.61,32.44 33.02,32.03 33.02,29.84 31.11,27.94 v30.28,27.94
  Bottom 0.203: U3.40 30.38,27.94 v30.28,27.94 | v30.78,42.16 31.62,42.16 R13.1 | R13.1 32.21,41.63 | R13.1 32.21,41.58 U$8.P$1
  Bottom 0.254: U$1.6 30.17,42.35 30.35,42.16 v30.78,42.16
PMID
  Bottom 0.254: U$1.23 28.94,46.88 28.32,47.5 C5.1
  pour Bottom (no thermals): 29.21,45.47 28.7,45.47 28.73,46.51 27.84,46.51 27.81,48.51 29.46,48.51 29.72,48.26 29.72,46.86 29.21,46.35
PWR_UB  (via drill 0.3)
  Top 0.203: U1.15 34.84,21.97 33.66,21.97 33.27,21.59 30.61,21.59 30.35,21.84 29.59,21.84 29.08,22.35 28.57,22.35 27.69,21.46 v27.69,20.83
  $GND 0.203: v27.23,37.39 27.3,37.31 27.3,35.1 27.58,34.82 27.58,32.94 27.18,32.54 27.18,30.23 27.56,29.84 27.56,20.95 v27.69,20.83
  Bottom 0.203: U5.4 23.24,36.8 23.24,37.77 23.42,37.95 24.54,37.95 24.79,37.69 R1.1 arc90 24.87,37.39 v27.23,37.39
PWR_UC
  Bottom 0.203: U3.28 24.74,31.33 24.74,31.98 24.51,32.21 24.51,32.92 24.13,33.3 U5.2 24.13,35.18 23.93,35.38 21.08,35.38 20.75,35.71 20.75,38.25 21.06,38.56 R29.1
REGN  (via drill 0.3)
  $+3V3 0.254: v26.54,47.24 26.29,46.86 26.29,42.67 27.36,41.6 27.36,38.48 v27.13,38.25
  Bottom 0.203: R18.1 25.91,39.57 26.19,39.29 26.57,39.29 26.9,38.96 26.9,38.48 v27.13,38.25
  Bottom 0.254: C25.1 26.54,47.77 v26.54,47.24 26.8,46.99 27.91,46.99 28.44,46.46 U$1.22 | 25.91,39.7 R18.1
RESET_UB  (via drill 0.3)
  Top 0.203: 35.06,24.89 U1.18 arc-90 35.01,24.84 31.39,24.84 30.99,24.43 30.99,23.88 30.23,23.11 28.83,23.11 26.92,21.21 v26.92,20.7
  $GND 0.203: v26.92,20.7 26.92,20.83 27.18,21.08 27.18,29.72 26.8,30.1 26.8,32.84 27.18,33.22 27.18,34.62 26.72,35.08 v26.72,36.73
  Bottom 0.203: U6.4 21.19,35.96 21.41,35.74 24.99,35.74 25.45,36.2 25.65,36.2 26.19,36.73 v26.72,36.73
RESET_UC
  Bottom 0.203: U3.24 23.49,29.75 23.49,32.03 22.25,33.27 R30.1 21.84,33.78 U6.2
RGB_BLUE  (via drill 0.3)
  Top 0.203: R11.2 26.31,35.18 24.77,35.18 24.16,34.57 24.16,32.79 v23.88,32.51
  $+3V3 0.203: v24,26.16 24.13,26.16 24.64,26.67 24.64,30.33 23.57,31.39 23.57,32.21 v23.88,32.51
  Bottom 0.152: U3.17 20.83,26.17 U$13.P$1
  Bottom 0.203: U3.17 22.13,26.16 v24,26.16
RGB_GREEN  (via drill 0.3)
  Top 0.203: R9.2 27.08,31.52 26.54,30.99 23.52,30.99 23.24,31.27 23.24,33.02 v23.37,33.15
  $+3V3 0.203: v24.77,24.51 24.77,25.53 25.4,26.16 25.4,31.88 24.13,33.15 v23.37,33.15
  Bottom 0.152: U3.16 20.83,23.34 20.83,22.94 U$12.P$1
  Bottom 0.203: U3.16 22.64,25.15 24.26,25.15 24.77,24.64 v24.77,24.51
RGB_RED  (via drill 0.3)
  Top 0.203: R12.2 25.22,31.7 v24.16,31.7
  $+3V3 0.203: v24,24.51 24,25.27 25.02,26.29 25.02,30.99 24.31,31.7 v24.16,31.7
  Bottom 0.152: U3.15 21.41,23.21 21.41,21.69 21.26,21.69 U$11.P$1
  Bottom 0.203: U3.15 22.71,24.51 v24,24.51
RI_UB  (via drill 0.3)
  Top 0.203: v28.83,21.72 28.7,21.59 28.7,20.83 29.59,19.94 30.73,19.94 31.62,19.05 31.62,17.91 32,17.53 32,13.84 33.27,12.57 34.84,12.57 U1.7
  $GND 0.203: v28.83,21.72 28.65,21.89 28.65,24.21 29.21,24.77 29.21,28.57 30.61,29.97 30.61,32.87 31.5,33.76 31.5,35.18 28.91,37.77 v28.91,39.04
  Bottom 0.203: U8.14 29.01,38.94 v28.91,39.04 29.08,39.04 29.46,39.42 R28.1
RI_UC
  Bottom 0.203: 29.61,32.32 U3.33 29.61,32.67 29.01,33.27 29.01,34.27 U8.7
RTS_UB  (via drill 0.3)
  Top 0.203: v32.64,16.64 33.02,16.26 35.06,16.26 U1.10
  $GND 0.203: v32.64,16.64 32.64,16.89 33.27,17.53 33.27,20.57 32.89,20.95 32.89,21.72 34.29,23.11 34.29,36.73 v32.97,38.05
  Bottom 0.203: U2.15 v32.97,38.05
RTS_UC
  Bottom 0.203: 30.39,31.41 U3.35 30.31,31.46 31.04,32.18 31.04,32.72 31.8,33.48 32.56,33.48 32.97,33.88 | 34.01,33.76 R24.1 arc90 34.09,33.88 32.97,33.88 | U2.6 32.97,33.88
RX  (via drill 0.3)
  Top 0.254: 13.63,47.5 U$10.P$25 13.71,47.42 15.34,47.42 16.05,46.71 16.05,40.46 17.14,39.37 JP1.4
  $+3V3 0.203: JP1.4 20.57,38.1 20.57,36.07 20.95,35.69 20.95,33.66 21.72,32.89 21.72,31.62 22.73,30.61 22.73,27.69 23.49,26.92 v24,26.92
  Bottom 0.203: U3.43 32.38,27.81 31.73,27.81 30.94,27.03 30.02,27.03 29.72,26.72 29.72,25.88 28.57,24.74 26.7,24.74 24.51,26.92 v24,26.92
RXD_UB  (via drill 0.3)
  Top 0.203: U1.13 34.98,19.3 32.38,19.3 30.48,21.21 v30.1,21.21
  $GND 0.203: v30.1,21.21 30.1,20.95 29.59,20.45 29.08,20.45 28.27,21.26 28.27,24.41 28.83,24.97 28.83,28.7 30.23,30.1 30.23,32.61 29.31,33.53 29.31,35.15 29.87,35.71 29.87,36.27 27.94,38.2 v27.94,38.25
  Bottom 0.203: U8.13 28.61,37.35 27.94,38.02 v27.94,38.25 27.94,38.33 27.56,38.71 27.56,38.86 27,39.42 27,39.57 R21.1
RXD_UC
  Bottom 0.203: U3.30 26.62,30.86 26.92,30.86 27.96,31.9 27.96,32.59 28.61,33.23 U8.8
SIM_CLK  (via drill 0.3)
  Top 0.203: U1.38 23.2,22.77 25.78,20.19 25.78,14.86 29.46,11.18 29.46,10.54 28.96,10.03 v28.07,10.03
  Top 0.406: v33.66,1.02 33.27,1.4 C12.1
  Bottom 0.305: v28.07,10.03 28.07,7.75 31.37,4.45 31.37,1.78 31.88,1.27 32.22,1.27 J1.C3 32.48,1.02
  Bottom 0.406: J1.C3 33.62,0.98 v33.66,1.02
SIM_IO  (via drill 0.3)
  Top 0.203: U1.39 23.79,21.67 25.4,20.07 25.4,14.73 28.7,11.43 v28.7,11.05
  Bottom 0.254: 32.49,13.11 33.58,14.2 C13.1
  Bottom 0.305: v28.7,11.05 28.7,10.29 29.21,9.78 30.73,9.78 31.24,10.29 31.24,12.19 31.62,12.57 32.5,12.57 J1.C7 | 32.49,12.61 32.49,13.11
  Bottom 0.406: 32.49,12.61 J1.C7
SIM_RST  (via drill 0.3)
  Top 0.203: U1.40 21.71,20.57 22.35,21.21 23.75,21.21 25.02,19.94 25.02,14.61 26.8,12.83 v26.8,10.03
  Top 0.406: v31.11,1.02 31.24,1.14 C10.1
  Bottom 0.305: v26.8,10.03 26.8,6.48 28.7,4.57 28.7,1.91 29.34,1.27 29.68,1.27 J1.C2 29.94,1.02
  Bottom 0.406: J1.C2 31.08,0.98 v31.11,1.02
SIM_VCC  (via drill 0.3)
  Top 0.406: C11.1 28.7,2.06 | 28.7,2.06 C14.1 | U1.41 21.41,19.3 23.37,19.3 24.38,18.29 24.38,10.54 24.89,10.03 v25.53,10.03 | v28.57,1.02 28.7,1.14 28.7,2.06
  Bottom 0.406: v28.57,1.02 28.54,0.98 J1.C1 27.4,1.02 27.3,1.02 26.57,1.75 26.57,4.29 25.53,5.33 v25.53,10.03 26.29,10.79 26.29,13.21 26.75,13.66 28.68,13.66 29.76,12.58 J1.C6
STAT  (via drill 0.3)
  Top 0.305: R4.1 27.94,39.27 v28.12,39.09
  $+3V3 0.254: v31.06,43.69 30.99,43.69 30.1,42.8 30.1,41.07 v28.12,39.09
  Bottom 0.254: U$1.4 v31.06,43.69
SW1
  pour Bottom (rank 2, no thermals): 27.46,45.57 25.48,45.57 25.1,45.69 25.1,47.17 24.94,47.57 24.16,48.23 21.16,48.23 20.95,48.44 20.95,49.91 21.16,50.11 25.22,50.11 26.03,49.3 26.03,46.69 26.44,46.28 27.46,46.28
SW2
  pour Top (rank 3, no thermals): 21.08,40.64 21.34,40.64 21.34,40.01 21.97,39.37 22.48,39.37 22.73,39.12 22.73,36.45 22.48,36.2 21.46,36.2 21.08,36.58
TS
  Bottom 0.203: 25.91,40.72 R18.2 | U$1.12 U$1.11 | R19.1 R18.2 | 26.94,41.78 U$1.12 | R18.2 25.91,41.25 26.01,41.35 26.59,41.35 26.94,41.7 U$1.12
TST  (via drill 0.3)
  $+3V3 0.203: JP1.6 20.95,32.64 20.95,31.37 21.97,30.35 21.97,29.46 v21.72,29.21
  Bottom 0.203: U3.20 21.72,28.7 v21.72,29.21
TX  (via drill 0.3)
  Top 0.254: JP1.3 17.3,41.91 16.59,42.62 16.59,47.68 15.8,48.46 13.67,48.46 U$10.P$26
  $+3V3 0.203: v24,27.69 23.75,27.69 23.11,28.32 23.11,30.73 22.1,31.75 22.1,33.02 21.34,33.78 21.34,35.81 20.95,36.2 20.95,38.23 20.57,38.61 20.57,39.88 19.3,41.15 JP1.3
  Bottom 0.203: U3.42 32.15,28.3 31.52,28.3 30.61,27.38 29.82,27.38 29.36,26.92 29.36,26.04 28.42,25.09 26.85,25.09 24.26,27.69 v24,27.69
TXD_UB  (via drill 0.3)
  Top 0.203: U1.12 32.93,18.37 v32.69,18.14
  $GND 0.203: v32.89,38.81 32.41,38.33 32.41,37.74 33.91,36.25 33.91,23.24 32.51,21.84 32.51,20.83 32.89,20.45 32.89,18.34 v32.69,18.14
  Bottom 0.203: U2.14 32.57,37.64 32.41,37.8 32.41,38.33 v32.89,38.81
TXD_UC  (via drill 0.3)
  $+3V3 0.203: v29.92,33.78 28.75,32.61 v28.75,32.28
  Bottom 0.203: U2.7 32.57,34.22 32.56,34.21 32.56,33.98 32.41,33.83 31.65,33.83 31.01,33.2 30.35,33.2 29.92,33.63 v29.92,33.78 29.92,33.73 | v28.75,32.28 28.75,32.18 27.05,30.48 26.3,30.48 U3.29 25.71,31.06
  Bottom 0.305: 25.71,31.06 25.15,31.62 R25.1
USB_DM
  Top 0.406: X1.D- 33.03,45.2 U$7.P$2
  Bottom 0.203: U$1.3 30.78,44.19 30.84,44.25 31.37,44.25 31.6,44.02 32.33,44.02 U$7.P$2 33.78,44.96 35.18,43.56 35.18,42.01 R6.2
USB_DM_UC
  Bottom 0.203: U3.44 34.04,28.77 34.04,28.96 33.4,29.59 33.4,31.88 33.66,32.13 34.8,32.13 35.18,32.51 35.18,38.89 34.65,39.42 34.31,39.42 34.04,39.7 R6.1
USB_DP
  Top 0.406: X1.D+ 32.38,45.34 U$7.P$1
  Bottom 0.203: U$1.2 31.74,44.69 U$7.P$1 32.89,45.85 33.66,45.85 35.56,43.94 35.56,41.45 R5.2
USB_DP_UC
  Bottom 0.203: U3.45 34.54,28.57 34.54,29.08 33.78,29.84 33.78,31.62 33.91,31.75 35.05,31.75 35.56,32.26 35.56,39.32 R5.1
V_BCKP  (via drill 0.3)
  Top 0.203: U1.2 34.66,7.37 34.16,7.87 30.61,7.87 30.23,8.26 30.23,10.92 v30.2,10.95
  $GND 0.203: v26.31,37.97 26.14,37.8 26.14,35.03 25.78,34.67 25.78,33.27 26.42,32.64 26.42,29.97 26.8,29.59 26.8,21.46 26.29,20.95 26.29,14.86 v30.2,10.95
  Bottom 0.203: R1.2 25.86,38.43 v26.31,37.97
V_INT  (via drill 0.3)
  Top 0.203: U1.4 35.06,9.65 32.77,9.65 31.62,10.79 31.62,17.02 v31.45,17.2
  $GND 0.203: v32.13,38.91 32.59,39.37 33.15,39.37 33.48,39.04 33.48,38.63 34.06,38.05 v34.11,38.05 34.11,37.74 34.67,37.19 34.67,22.99 33.27,21.59 33.27,21.08 33.66,20.7 33.66,16.76 32.89,16 32,16 31.45,16.56 v31.45,17.2
  Bottom 0.152: U8.2 30.53,36.01 C21.1
  Bottom 0.178: C21.1 30.81,36.35
  Bottom 0.203: C22.1 34.44,36.35 | 34.44,36.35 34.11,36.01 U2.2 | 34.44,36.35 33.91,36.88 33.91,37.85 v34.11,38.05 | C21.1 30.89,36.35 31.5,36.96 31.5,37.74 31.29,37.95 31.29,38.48 31.73,38.91 v32.13,38.91 | R3.2 33.5,17.2 v31.45,17.2
VBAT  (via drill 0.3)
  $GND 0.203: JP2.16 35.81,40.64 35.81,21.34 34.8,20.32 34.8,14.86 33.76,13.82 33.12,13.82 31.47,12.17 29.54,12.17 28.14,13.56 28.14,17.32 v27.2,18.26
  $GND 0.254: v27.2,18.26 28.73,18.26 30.84,16.15 30.84,15.7 v30.91,15.62
  Bottom 0.203: U3.1 27.07,18.39 27.08,18.39 v27.2,18.26
  Bottom 0.305: J3.2 v30.91,15.62
VBUS  (via drill 0.3)
  Top 0.61: v35.05,45.97 35.2,46.13
  other vias: 34.42,45.97
  pour Top (rank 2, no thermals): 33.66,45.85 33.66,48.13 35.18,48.13 35.18,50.29 37.97,50.29 37.97,47.75 36.2,47.75 36.2,45.59 33.91,45.59
  pour Bottom (rank 2, no thermals): 32.51,46.86 35.31,46.86 35.56,46.61 35.56,45.85 35.31,45.59 34.42,45.59 33.78,46.23 32.51,46.23
VIN  (via drill 0.3)
  $+3V3 1.016: JP1.1 21.08,48.77 27.2,48.77 27.2,48.74 27.94,48.01 27.94,46.74 28.7,45.97 30.12,45.97 v30.33,45.74
  other vias: 30.05,46.1
  pour Bottom (rank 3, no thermals): 29.34,45.47 29.34,46.23 29.72,46.61 29.97,46.86 29.97,47.75 30.48,47.75 30.61,47.75 30.61,48.39 31.37,48.39 33.78,48.39 34.16,48.39 34.16,46.23 32.38,46.23 32.13,46.23 30.99,45.09 29.72,45.09 29.72,45.47
WKP  (via drill 0.3)
  $+3V3 0.203: JP1.5 20.57,35.56 20.57,33.53 21.34,32.77 21.34,31.5 22.35,30.48 22.35,27.56 23.37,26.54 23.37,24.21 23.82,23.75 v24.38,23.75
  Bottom 0.203: v24.38,23.75 24.18,23.95 22.86,23.95 U3.14
(copper drawn outside any net)
  shapes: Bottom area x1

## Text on the board
tPlace: LI+ | VUSB | VIN | 3V3 | D+ | D- | GND | RST | + | TX | VBAT | RX | GND | D7 | WKP | GPS | DAC | D6 | MODE | RESET | A5 | D5 | A4 | D4 | A3 | D3 | A2 | D2 | A1 | D1 | A0 | D0 | B5 | C5 | B4 | C4 | B3 | C3 | B2 | C2 | B1 | C1 | B0 | C0
bPlace: PMID | SCL | SDA | MODE | v020
tDocu: NOTES: / / Layer stack up: / 1 - GTL - Top Signal, GND / 2 - G2L - Inner Signal, GND, +3V8 / 15 - G15L - Inner Signal, GND, +3V3 / 16 - GBL - Bottom Signal, GND | Reference Designs ARE PROVIDED "AS IS" AND "WITH ALL FAULTS. PARTICLE INDUSTRIES, INC / ("PARTICLE") DISCLAIMS ALL OTHER WARRANTIES, EXPRESS OR IMPLIED, REGARDING / PRODUCTS OR THE REFERENCE DESIGNS, INCLUDING BUT NOT LIMITED TO, ANY / IMPLIED WARRANTIES OF MERCHANTABILITY, FITNESS FOR A PARTICULAR PURPOSE, / OR NON-INFRINGEMENT. / / Particle may make changes to specifications and product descriptions at any / time, without notice. The Customer must not rely on the absence or / characteristics of any features or instructions marked "reserved" or / "undefined." Particle reserves these for future definition and shall have / no responsibility whatsoever for conflicts or incompatibilities arising / from future changes to them. The product information on the Web Site or / Materials is subject to change without notice. Do not finalize a design / with this information. / Particle is a registered trademark.
bDocu: PMID | BLUE | GREEN | RED | VBAT-3V3 / JUMPER | MODE BTN TEST POINT